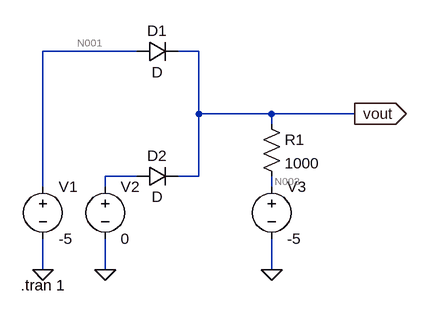
[diagram p0: schematic 2.asc]
2.asc, the LTspice schematic file:
Version 4
SHEET 1 880 680
WIRE 176 -128 32 -128
WIRE 272 -128 240 -128
WIRE 272 -32 272 -128
WIRE 384 -32 272 -32
WIRE 512 -32 384 -32
WIRE 384 -16 384 -32
WIRE 176 64 128 64
WIRE 272 64 272 -32
WIRE 272 64 240 64
WIRE 32 80 32 -128
WIRE 128 80 128 64
WIRE 384 80 384 64
WIRE 32 208 32 160
WIRE 128 208 128 160
WIRE 384 208 384 160
FLAG 32 208 0
FLAG 128 208 0
FLAG 384 208 0
FLAG 512 -32 vout
IOPIN 512 -32 Out
SYMBOL voltage 32 64 R0
WINDOW 123 0 0 Left 0
WINDOW 39 0 0 Left 0
SYMATTR InstName V1
SYMATTR Value -5
SYMBOL voltage 128 64 R0
WINDOW 123 0 0 Left 0
WINDOW 39 0 0 Left 0
SYMATTR InstName V2
SYMATTR Value 0
SYMBOL voltage 384 64 R0
WINDOW 123 0 0 Left 0
WINDOW 39 0 0 Left 0
SYMATTR InstName V3
SYMATTR Value -5
SYMBOL diode 176 -144 M90
WINDOW 0 0 32 VBottom 2
WINDOW 3 32 32 VTop 2
SYMATTR InstName D1
SYMBOL diode 176 48 M90
WINDOW 0 0 32 VBottom 2
WINDOW 3 32 32 VTop 2
SYMATTR InstName D2
SYMBOL res 368 -32 R0
SYMATTR InstName R1
SYMATTR Value 1000
TEXT -2 232 Left 2 !.tran 1

The netlist it stands for:
* 2.asc
V1 N001 0 -5
V2 N002 0 0
V3 N003 0 -5
D1 N001 vout D
D2 N002 vout D
R1 vout N003 1000
.model D D
.lib standard.dio
.tran 1
.backanno
.end

* Results of the author's LTspice run, read from the files saved beside the schematic
* Operating Point, zero values left out:
*   V(n001) = -5 V
*   V(n003) = -5 V
*   V(vout) = -692.9 mV
*   I(D2) = 4.307 mA
*   I(D1) = -4.317 pA
*   I(R1) = 4.307 mA
*   I(V3) = 4.307 mA
*   I(V2) = -4.307 mA
*   I(V1) = 4.317 pA